# EAGLE design climate_control (EAGLE 7.4.0)
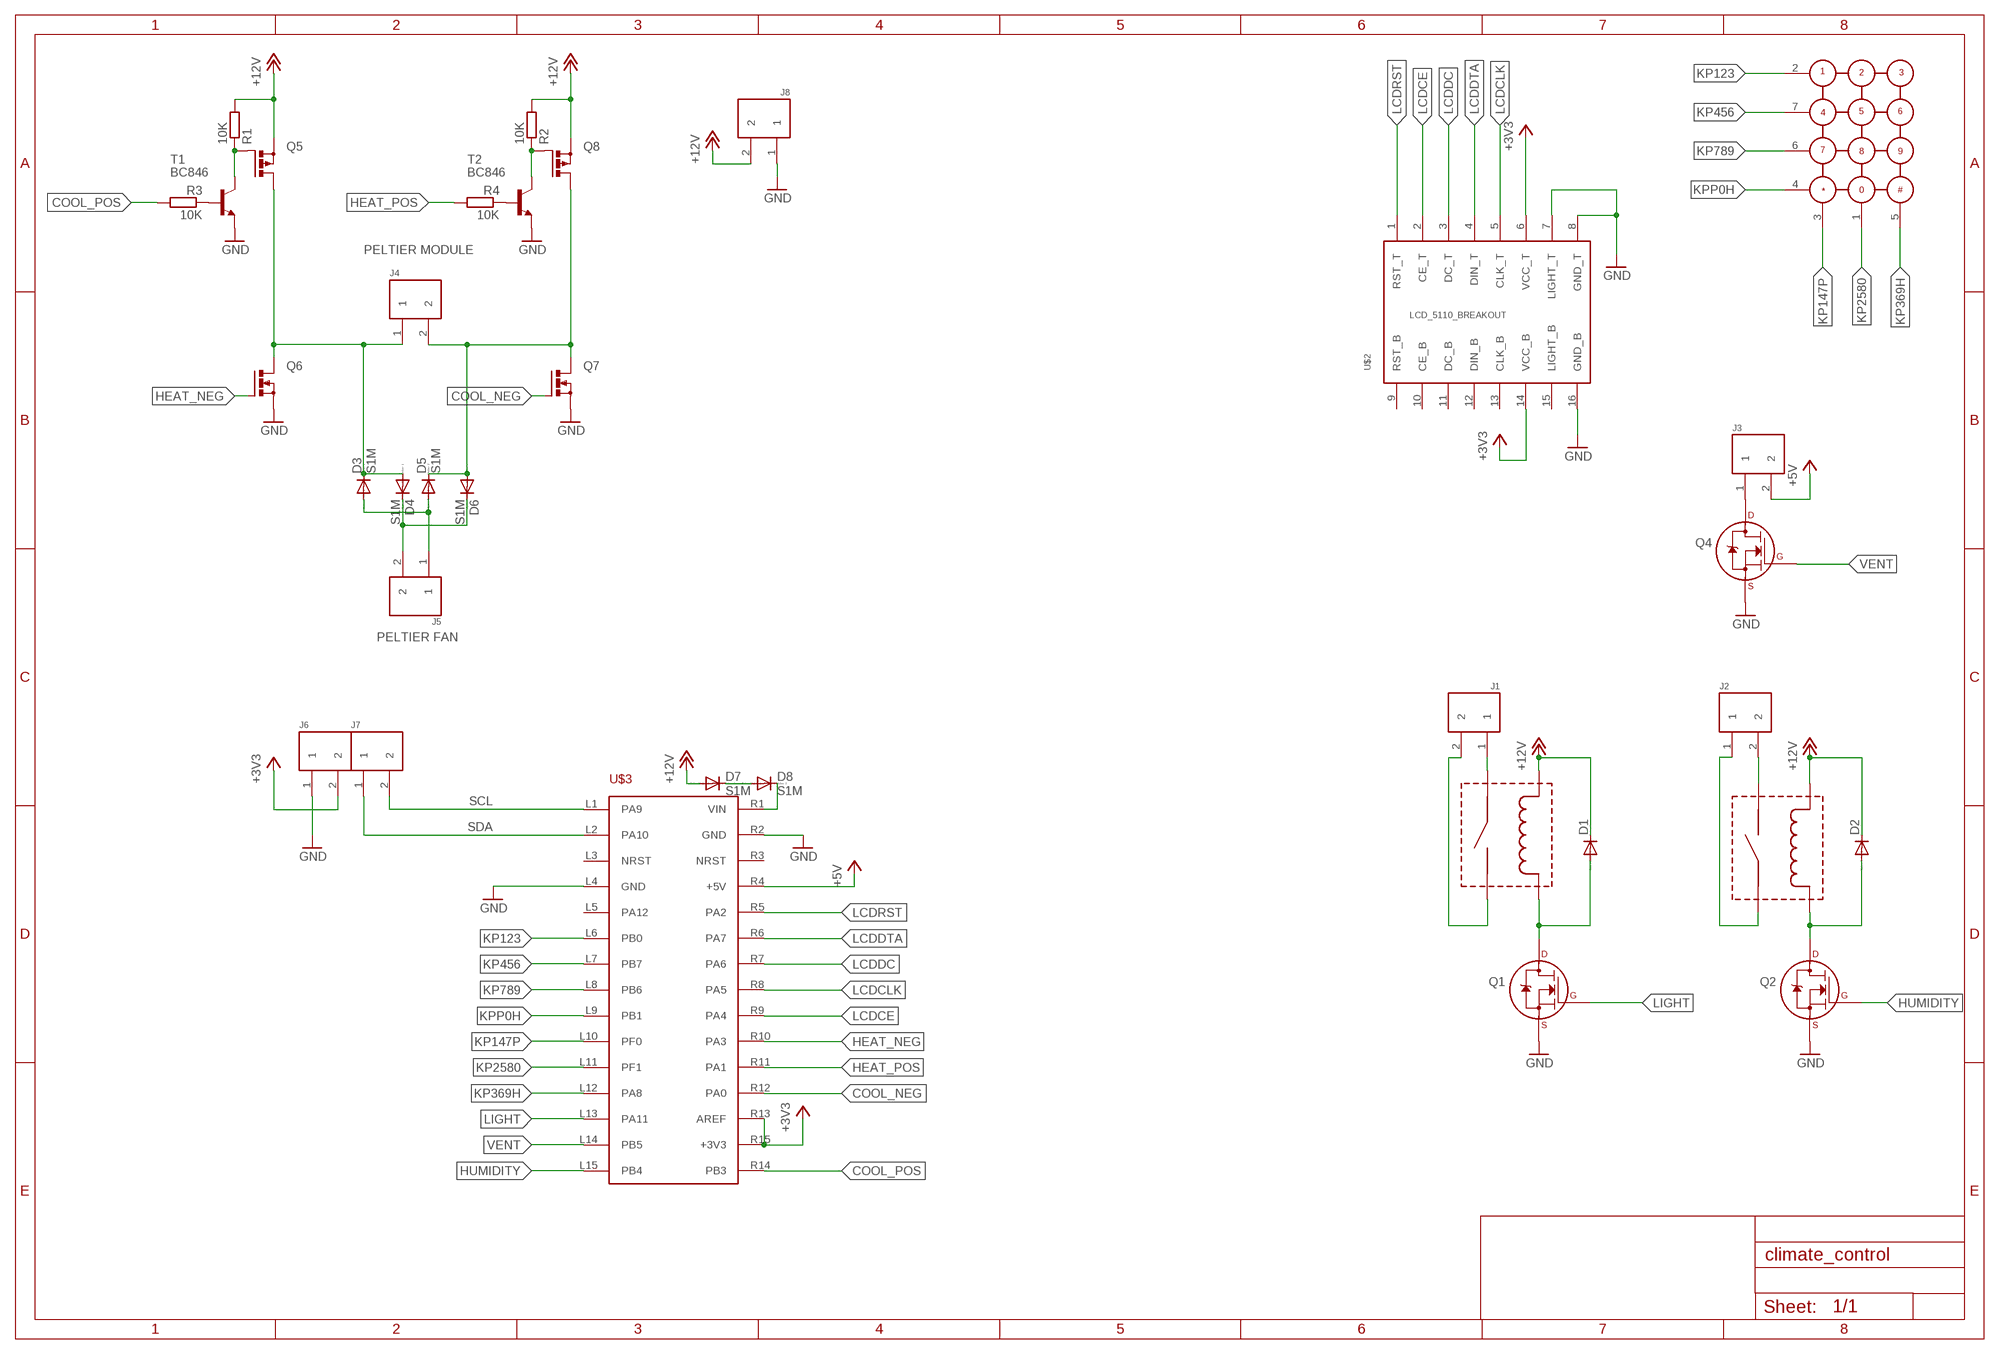
[diagram p0: schematic, sheet 1]

## Parts
D1  DIODE-DO-214AC  [DO-214AC]
D2  DIODE-DO-214AC  [DO-214AC]
D3  S1M  [SMA]
D4  S1M  [SMA]
D5  S1M  [SMA]
D6  S1M  [SMA]
D7  S1M  [SMA]
D8  S1M  [SMA]
J1  TERMINAL_PCB_508_X2  [TERMINAL_PCB_508_PITCH]
J2  TERMINAL_PCB_508_X2  [TERMINAL_PCB_508_PITCH]
J3  TERMINAL_PCB_508_X2  [TERMINAL_PCB_508_PITCH]
J4  TERMINAL_PCB_508_X2  [TERMINAL_PCB_508_PITCH]
J5  TERMINAL_PCB_508_X2  [TERMINAL_PCB_508_PITCH]
J6  TERMINAL_PCB_508_X2  [TERMINAL_PCB_508_PITCH]
J7  TERMINAL_PCB_508_X2  [TERMINAL_PCB_508_PITCH]
J8  TERMINAL_PCB_508_X2  [TERMINAL_PCB_508_PITCH]
Q1  2N7000_TO92  [TO-92]
Q2  2N7000_TO92  [TO-92]
Q4  2N7000_TO92  [TO-92]
Q5  PMOSFET_PTO220BV  [TO220BV]
Q6  PMOSFET_NTO220BV  [TO220BV]
Q7  PMOSFET_NTO220BV  [TO220BV]
Q8  PMOSFET_PTO220BV  [TO220BV]
R1  10K  R-EU_R0805  [R0805]
R2  10K  R-EU_R0805  [R0805]
R3  10K  R-EU_R0805  [R0805]
R4  10K  R-EU_R0805  [R0805]
T1  BC846  [SOT23]
T2  BC846  [SOT23]
U$1  KEYPAD12  [KEYPAD12]
U$2  LCD_5110_BREAKOUT  [LCD_5110_BREAKOUT]
U$3  NUCLEO_F031  [NUCLEO_30]
U$5  RELAY_JZC-33F  [RELAY_JZC-33F]
U$7  RELAY_JZC-33F  [RELAY_JZC-33F]

## Nets
+3V3: J6.2 U$2.6(VCC_T) U$2.14(VCC_B) U$3.R13(AREF) U$3.R15(+3V3)
+5V: J3.2 U$3.R4(+5V)
+12V: D1.C D2.C D7.A J8.2 Q5.S Q8.S R1.2 R2.2 U$5.COIL1 U$7.COIL2
COOL_NEG: Q7.G U$3.R12(PA0)
COOL_POS: R3.2 U$3.R14(PB3)
GND: J6.1 J8.1 Q1.1(S) Q2.1(S) Q4.1(S) Q6.S Q7.S T1.2(E) T2.2(E) U$2.7(LIGHT_T) U$2.8(GND_T) U$2.16(GND_B) U$3.L4(GND) U$3.R2(GND)
HEAT_NEG: Q6.G U$3.R10(PA3)
HEAT_POS: R4.2 U$3.R11(PA1)
HUMIDITY: Q2.2(G) U$3.L15(PB4)
KP123: U$1.2 U$3.L6(PB0)
KP147P: U$1.3(147*) U$3.L10(PF0)
KP369H: U$1.5(369#) U$3.L12(PA8)
KP456: U$1.7 U$3.L7(PB7)
KP789: U$1.6 U$3.L8(PB6)
KP2580: U$1.1 U$3.L11(PF1)
KPP0H: U$1.4(*0#) U$3.L9(PB1)
LCDCE: U$2.2(CE_T) U$3.R9(PA4)
LCDCLK: U$2.5(CLK_T) U$3.R8(PA5)
LCDDC: U$2.3(DC_T) U$3.R7(PA6)
LCDDTA: U$2.4(DIN_T) U$3.R6(PA7)
LCDRST: U$2.1(RST_T) U$3.R5(PA2)
LIGHT: Q1.2(G) U$3.L13(PA11)
N$1: D3.A D5.A J5.1
N$2: D7.C D8.A
N$3: D4.C D6.C J5.2
N$4: D3.C D4.A J4.1 Q5.D Q6.D
N$5: D5.C D6.A J4.2 Q7.D Q8.D
N$6: Q5.G R1.1 T1.3(C)
N$7: Q8.G R2.1 T2.3(C)
N$8: R3.1 T1.1(B)
N$9: R4.1 T2.1(B)
N$10: D8.C U$3.R1(VIN)
N$22: D1.A Q1.3(D) U$5.COIL2
N$23: J1.1 U$5.CONTACT1
N$25: J1.2 U$5.CONTACT2
N$26: D2.A Q2.3(D) U$7.COIL1
N$27: J2.2 U$7.CONTACT2
N$28: J2.1 U$7.CONTACT1
N$36: J3.1 Q4.3(D)
SCL: J7.2 U$3.L1(PA9)
SDA: J7.1 U$3.L2(PA10)
VENT: Q4.2(G) U$3.L14(PB5)
Unconnected: U$2.9(RST_B) U$2.10(CE_B) U$2.11(DC_B) U$2.12(DIN_B) U$2.13(CLK_B) U$2.15(LIGHT_B) U$3.L3(NRST) U$3.L5(PA12) U$3.R3(NRST)

## Notes on the sheet
- PELTIER MODULE
- PELTIER FAN

## Library data of the parts
D1 D2 = diode:DIODE-: DIODE
D3-D8 = diode:S1M
J1-J8 = custom:TERMINAL_PCB_508_X2
Q1 Q2 Q4 = transistors:2N700*: 2N7000, 2N7002, NDS7002A N-channel enhancement mode MOSFET
Q5 Q8 = transistor-power:PMOSFET_P: Power MOSFET P-Channel
Q6 Q7 = transistor-power:PMOSFET_N: Power MOSFET N-Channel
R1-R4 = rcl:R-EU_: RESISTOR, European symbol; SPEC: 100mW, +/-1%, 50V
T1 T2 = transistor:BC846: NPN TRANSISTOR
U$1 = KEYPAD12:KEYPAD12
U$2 = LCD5110:LCD_5110_BREAKOUT
U$3 = custom_module:NUCLEO_F031
U$5 U$7 = custom:RELAY_JZC-33F

## Board
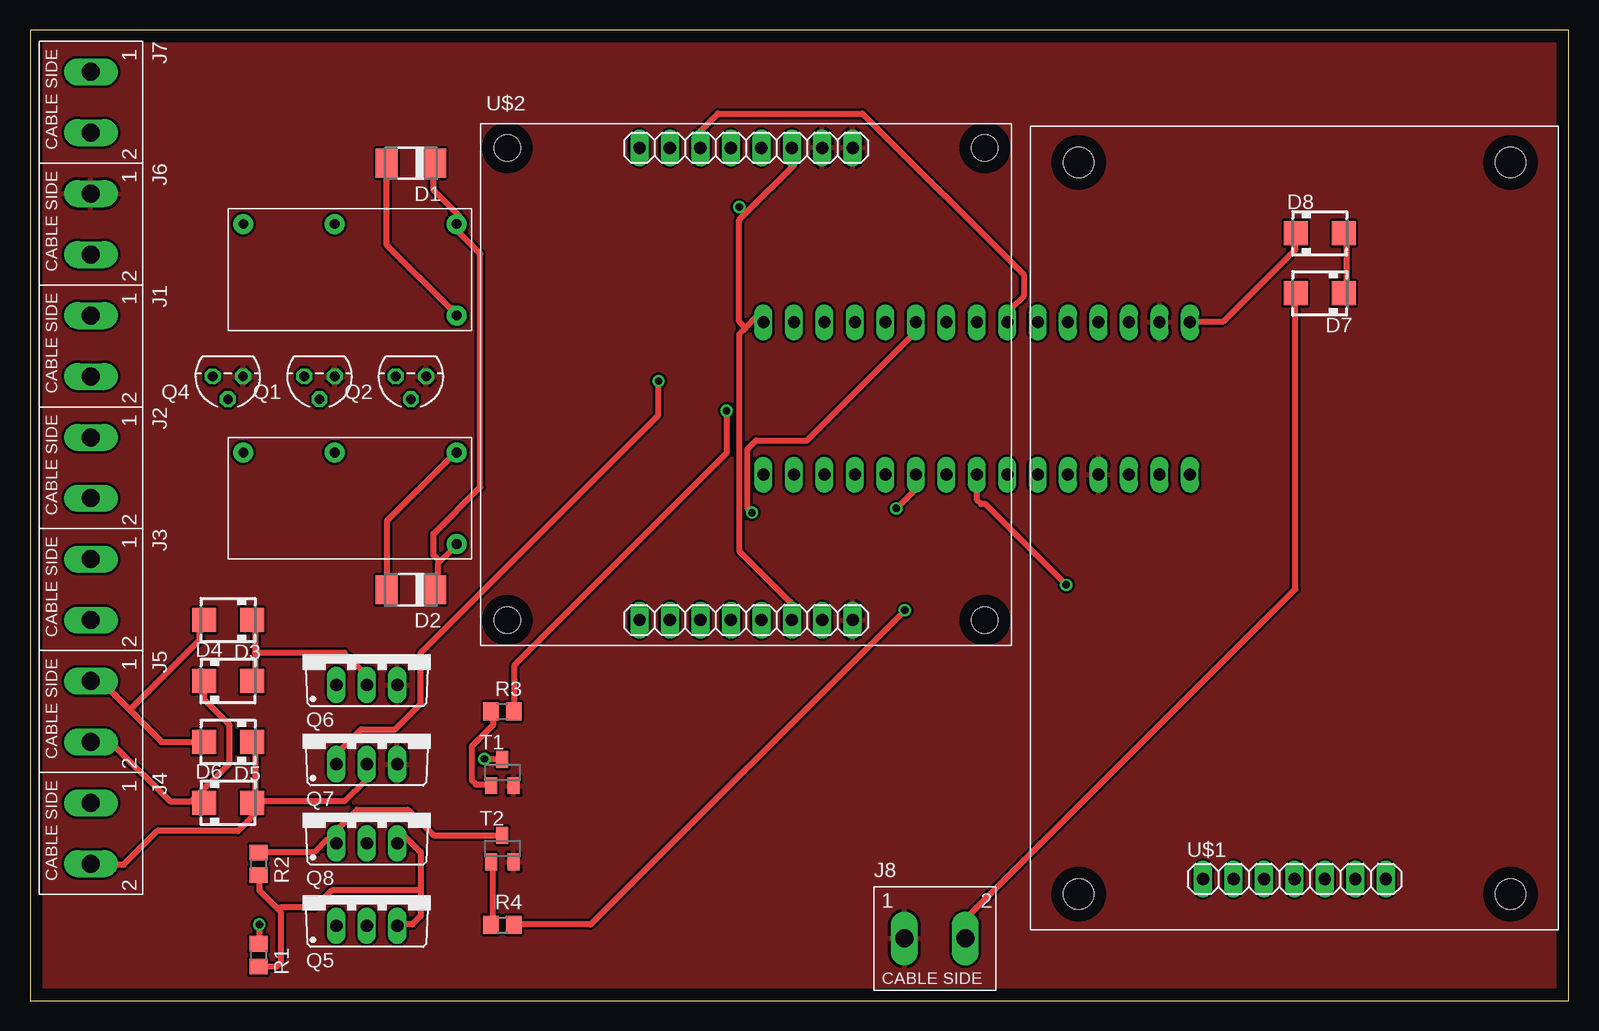
[diagram p1: board, top side]
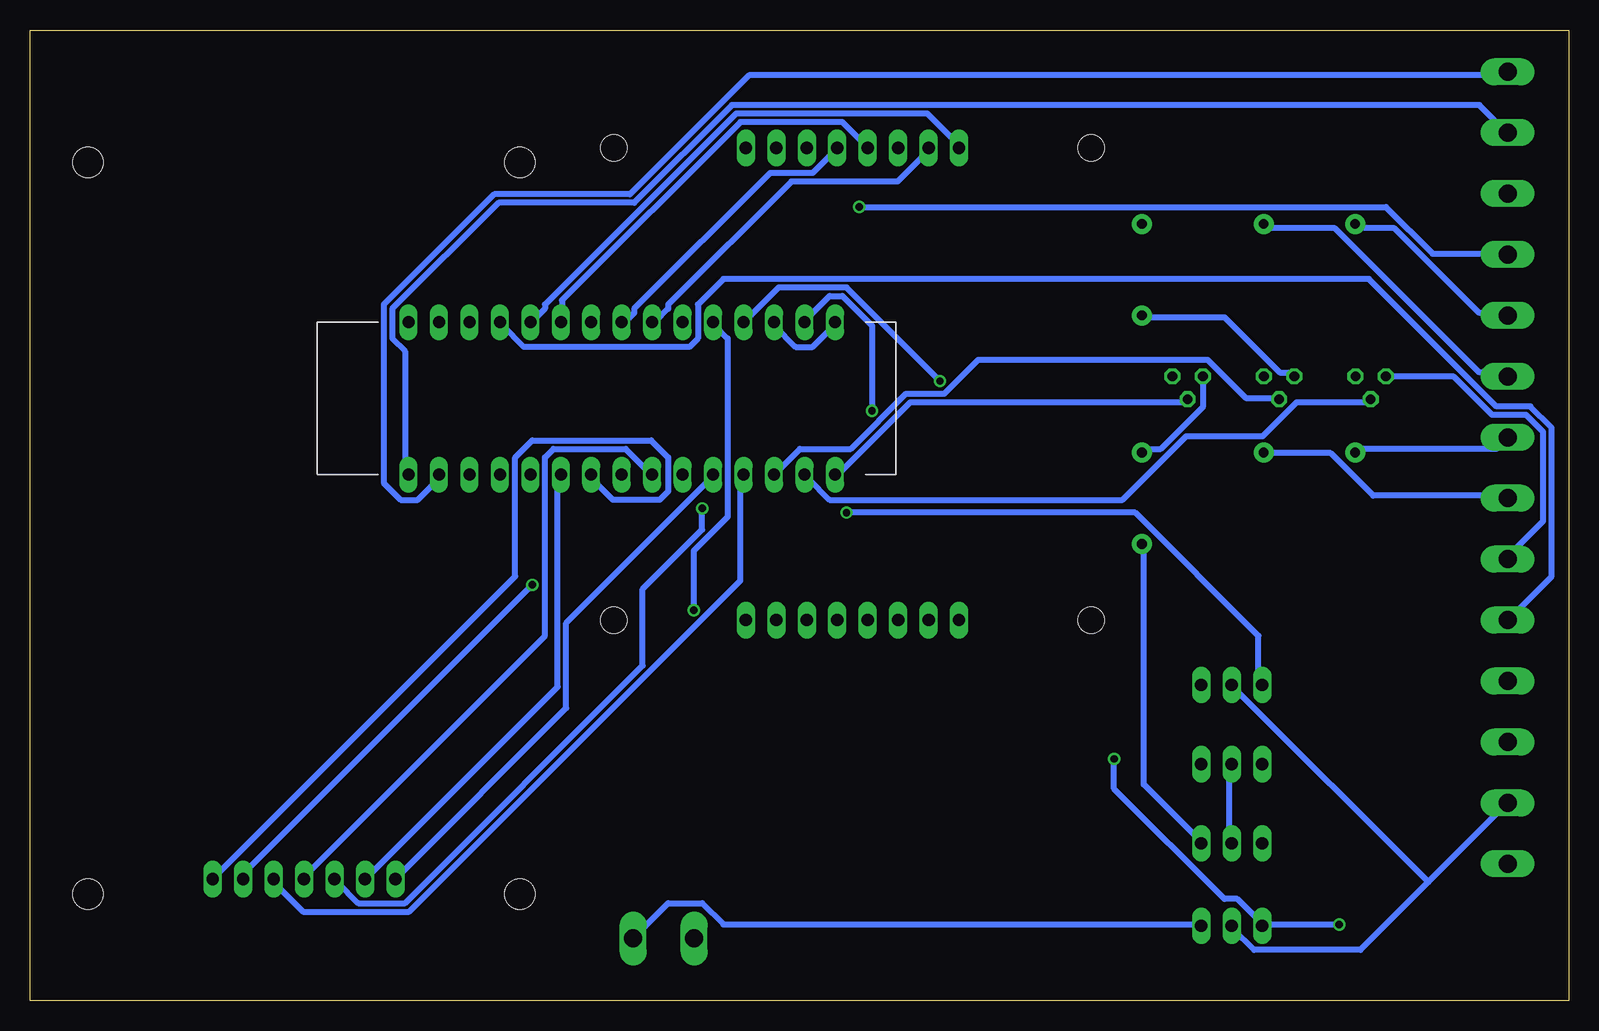
[diagram p2: board, bottom side, seen from below]

Size 128.25 x 80.95 mm. Coordinates in mm from the lower left corner, seen from the top.
Outline: 0,0 128.25,0 128.25,80.95 0,80.95 0,0
Copper layers (1*16): Top 0.035mm / dielectric 1.5mm / Bottom 0.035mm
Design rules "default *": minimum track width 20mil, minimum drill 24mil, track to track 0.2mm, track to pad 0.2mm, pad to pad 0.2mm, via to via 0.2mm, smd to smd 0.2mm, copper to edge 40mil, drill to drill 8mil, minimum pad ring 10mil, minimum via ring 8mil, stop-mask expansion 4mil, vias tented up to drill 0mil, thermal gap 10mil

### Footprints (pad centres in the part's own frame; a part is rotated, then mirrored left to right if it is on the bottom)
DO-214AC = smd 1.8 x 2.4: A 2.025,0; C -2.025,0
SMA = smd 2 x 2: A 2,0; C -2,0
TERMINAL_PCB_508_PITCH = drill 1.5 long: 1 0,0; 2 5.08,0
TO-92 = drill 0.813 octagon: 1 -1.27,0; 2 0,1.905; 3 1.27,0
TO220BV = drill 1.016 long: D 0,-2.54; G -2.54,-2.54; S 2.54,-2.54
R0805 = smd 1.3 x 1.5: 1 -0.95,0; 2 0.95,0
SOT23 = smd 1 x 1.4: 1 -0.95,-1.1; 2 0.95,-1.1; 3 0,1.1
KEYPAD12 = drill 1.016 long: 1 -7.62,0; 2 -5.08,0; 3 -2.54,0; 4 0,0; 5 2.54,0; 6 5.08,0; 7 7.62,0 | hole 2.5: -18,-1.25; 18,-1.25; -18,59.75; 18,59.75
LCD_5110_BREAKOUT = drill 1.016 long: 1 0,0; 2 2.54,0; 3 5.08,0; 4 7.62,0; 5 10.16,0; 6 12.7,0; 7 15.24,0; 8 17.78,0; 9 0,-39.37; 10 2.54,-39.37; 11 5.08,-39.37; 12 7.62,-39.37; 13 10.16,-39.37; 14 12.7,-39.37; 15 15.24,-39.37; 16 17.78,-39.37 | hole 2.2: -11,0; 28.8,0; -11,-39.37; 28.8,-39.37
NUCLEO_30 = drill 1 long: L1 -7.62,12.7; L2 -7.62,10.16; L3 -7.62,7.62; L4 -7.62,5.08; L5 -7.62,2.54; L6 -7.62,0; L7 -7.62,-2.54; L8 -7.62,-5.08; L9 -7.62,-7.62; L10 -7.62,-10.16; L11 -7.62,-12.7; L12 -7.62,-15.24; L13 -7.62,-17.78; L14 -7.62,-20.32; L15 -7.62,-22.86; R1 5.08,12.7; R2 5.08,10.16; R3 5.08,7.62; R4 5.08,5.08; R5 5.08,2.54; R6 5.08,0; R7 5.08,-2.54; R8 5.08,-5.08; R9 5.08,-7.62; R10 5.08,-10.16; R11 5.08,-12.7; R12 5.08,-15.24; R13 5.08,-17.78; R14 5.08,-20.32; R15 5.08,-22.86
RELAY_JZC-33F = drill 0.8 pad 1.676: COIL1 10.16,0; COIL2 10.16,-7.62; CONTACT1 -7.62,0; CONTACT2 0,0

### Placement (x,y rotation side)
D1  31.75,69.85 180 top
D2  31.75,34.29 180 top
D3  16.51,31.75 180 top
D4  16.51,26.67 0 top
D5  16.51,21.59 180 top
D6  16.51,16.51 0 top
D7  107.5,59 180 top
D8  107.5,64 0 top
J1  5.08,57.15 270 top
J2  5.08,46.99 270 top
J3  5.08,36.83 270 top
J4  5.08,16.51 270 top
J5  5.08,26.67 270 top
J6  5.08,67.31 270 top
J7  5.08,77.47 270 top
J8  72.89,5.21 0 top
Q1  24.13,52.07 180 top
Q2  31.75,52.07 180 top
Q4  16.49,52.07 180 top
Q5  28.08,8.81 0 top
Q6  28.08,28.88 0 top
Q7  28.08,22.28 0 top
Q8  28.08,15.68 0 top
R1  19.05,3.81 270 top
R2  19.05,11.43 270 top
R3  39.37,24.13 0 top
R4  39.37,6.35 0 top
T1  39.37,19.05 0 top
T2  39.37,12.7 0 top
U$1  105.41,10.16 0 top
U$2  50.8,71.12 0 top
U$3  84,51.5 90 bottom
U$5  25.4,64.77 0 top
U$7  25.4,45.72 0 top

### Tracks (layer width: path | path; a pad name or v marks a point on that pad's centre or on a via)
+3V3  (via drill 0.61)
  Top 0.508: 59.65,56.11 60.53,56.99 60.89,56.99 61.24,56.64 U$3.R15 | 59.65,56.11 59.12,55.58 59.12,37.52 63.37,33.28 63.37,31.86 U$2.14 | 59.65,65.67 59.12,65.14 59.12,56.64 59.65,56.11 | 59.65,65.67 63.72,69.74 63.72,70.8 U$2.6 | 59.65,65.67 v59.12,66.2
  Bottom 0.508: U$3.R15 61.24,56.29 63.01,54.52 64.43,54.52 66.2,56.29 U$3.R13 | v59.12,66.2 15.22,66.2 11.33,62.3 5.31,62.3 J6.2
+5V
  Bottom 0.508: U$3.R4 88.85,56.29 87.08,54.52 73.28,54.52 72.57,55.22 72.57,58.06 70.45,60.18 16.64,60.18 6.02,49.56 3.19,49.56 1.42,47.79 1.42,35.4 4.96,31.86 J3.2
+12V
  Top 0.508: D1.C 33.63,69.74 33.63,67.61 35.75,65.49 35.75,64.78 U$5.COIL1 35.75,64.43 35.75,64.07 37.52,62.3 37.52,42.83 33.63,38.94 33.63,37.17 34.16,36.64 | 34.16,36.64 35.05,37.52 35.05,37.88 35.4,38.23 U$7.COIL2 | 34.16,36.64 33.98,36.46 33.98,34.34 D2.C | 20.71,7.61 19.12,9.2 19.12,10.27 R2.2 | 20.71,7.61 20.89,7.43 20.89,3.19 20.53,2.83 19.12,2.83 R1.2 | 32.57,9.2 32.57,12.39 31.15,13.81 30.8,13.81 30.44,13.45 Q8.S | 32.57,9.2 32.57,7.08 31.86,6.37 30.8,6.37 Q5.S | 32.57,9.2 25.13,9.2 23.72,7.79 20.89,7.79 20.71,7.61 | D7.A 105.49,58.76 105.49,34.34 78.23,7.08 78.23,5.31 J8.2
  Bottom 0.508: U$7.COIL2 35.4,37.88 35.4,18.05 30.8,13.45 Q8.S | Q5.S 30.8,6.37 70.45,6.37 72.22,8.14 75.05,8.14 77.88,5.31 J8.2
COOL_NEG  (via drill 0.61)
  Top 0.508: v52.39,51.68 52.39,48.85 32.57,29.03 32.57,24.78 30.44,22.66 27.61,22.66 25.84,20.89 25.84,19.82 Q7.G
  Bottom 0.508: v52.39,51.68 60.18,59.47 65.84,59.47 68.68,56.64 U$3.R12
COOL_POS  (via drill 0.61)
  Top 0.508: v58.06,49.21 58.06,45.67 40.36,27.97 40.36,24.43 R3.2
  Bottom 0.508: v58.06,49.21 58.06,56.29 60.53,58.76 61.6,58.76 63.72,56.64 U$3.R14
GND
  pour Top: 0.5,80.5 0.5,0.5 128,0.5 128,80.5
HEAT_NEG  (via drill 0.61)
  Top 0.508: v60.18,40.71 59.83,41.06 59.83,46.02 60.53,46.73 64.78,46.73 73.63,55.58 73.63,56.29 U$3.R10
  Bottom 0.508: v60.18,40.71 36.11,40.71 25.84,30.44 25.84,26.55 Q6.G
HEAT_POS  (via drill 0.61)
  Top 0.508: v72.92,32.57 46.73,6.37 40.36,6.37 R4.2
  Bottom 0.508: v72.92,32.57 72.92,37.52 70.09,40.36 70.09,55.22 71.15,56.29 U$3.R11
HUMIDITY
  Bottom 0.508: Q2.2 31.86,49.91 54.87,49.91 60.89,43.9 U$3.L15
KP123
  Bottom 0.508: U$3.L6 84.25,43.54 84.25,26.2 100.18,10.27 U$1.2
KP147P  (via drill 0.61)
  Top 0.508: v72.22,41.06 73.63,42.48 73.63,43.54 U$3.L10
  Bottom 0.508: v72.22,41.06 72.22,39.29 77.17,34.34 77.17,27.97 97,8.14 100.89,8.14 102.66,9.91 U$1.3
KP369H
  Bottom 0.508: U$3.L12 69.03,43.54 69.03,35.05 96.64,7.43 105.49,7.43 107.97,9.91 U$1.5
KP456
  Bottom 0.508: U$3.L7 81.42,43.54 79.65,41.77 75.76,41.77 75.05,42.48 75.05,45.31 76.46,46.73 86.38,46.73 87.79,45.31 87.79,35.4 112.93,10.27 U$1.7
KP789  (via drill 0.61)
  Top 0.508: v86.38,34.69 79.65,41.42 79.3,41.42 78.94,41.77 78.94,43.54 U$3.L8
  Bottom 0.508: v86.38,34.69 110.8,10.27 U$1.6
KP2580
  Bottom 0.508: U$3.L11 71.51,43.54 83.54,31.51 83.54,24.43 97.7,10.27 U$1.1
KPP0H
  Bottom 0.508: U$3.L9 76.46,43.9 78.59,46.02 84.61,46.02 85.31,45.31 85.31,30.44 105.49,10.27 U$1.4
LCDCE
  Bottom 0.508: U$3.R9 76.11,56.64 75.05,57.7 75.05,58.06 64.78,68.32 55.93,68.32 53.45,70.8 U$2.2
LCDCLK
  Bottom 0.508: U$3.R8 78.59,56.64 77.88,57.35 77.88,57.7 66.55,69.03 63.01,69.03 61.24,70.8 U$2.5
LCDDC
  Top 0.508: U$3.R7 81.77,56.64 81.77,57.7 82.84,58.76 82.84,60.53 69.38,73.99 57.35,73.99 55.93,72.57 55.93,71.15 U$2.3
LCDDTA
  Bottom 0.508: U$3.R6 83.9,56.64 83.9,58.41 69.03,73.28 60.53,73.28 58.41,71.15 U$2.4
LCDRST
  Bottom 0.508: U$3.R5 86.38,56.64 85.31,57.7 85.31,58.06 69.38,73.99 53.45,73.99 50.62,71.15 U$2.1
LIGHT
  Bottom 0.508: Q1.2 24.43,50.27 26.9,50.27 30.09,53.45 49.21,53.45 52.04,50.62 55.22,50.62 59.83,46.02 64.07,46.02 66.2,43.9 U$3.L13
N$1
  Top 0.508: 8.32,24.25 6.02,26.55 5.31,26.55 J5.1 | 8.32,24.25 10.97,21.59 14.16,21.59 D5.A | 8.32,24.25 14.16,30.09 14.16,31.51 D3.A
N$2
  Top 0.508: D7.C 109.74,59.12 109.74,63.72 D8.A
N$3
  Top 0.508: 13.45,16.64 11.68,16.64 7.08,21.24 5.31,21.24 J5.2 | 13.45,16.64 14.16,16.64 D6.C | 13.45,16.64 16.64,19.82 16.64,23.01 14.51,25.13 14.51,26.55 D4.C
N$4
  Top 0.508: 18.76,29.03 18.76,31.51 D3.C | 18.76,29.03 18.76,26.9 D4.A | 18.76,29.03 26.2,29.03 27.97,27.26 27.97,26.55 Q6.D
  Bottom 0.508: 11.68,9.91 5.31,16.28 J4.1 | 11.68,9.91 17.35,4.25 26.2,4.25 27.97,6.02 Q5.D | 11.68,9.91 27.97,26.2 Q6.D
N$5
  Top 0.508: 18.76,16.64 18.76,21.24 D5.C | 18.76,16.64 26.2,16.64 27.97,18.41 27.97,19.47 Q7.D | 18.76,16.64 D6.A 18.76,16.28 18.76,15.58 17.35,14.16 10.62,14.16 7.79,11.33 5.31,11.33 J4.2
  Bottom 0.508: Q8.D 28.32,13.45 28.32,19.47 Q7.D
N$6  (via drill 0.61)
  Top 0.508: v37.88,20.18 39.29,20.18 T1.3 | v19.12,6.37 19.12,4.96 R1.1
  Bottom 0.508: v37.88,20.18 37.88,17.7 28.67,8.5 27.61,8.5 25.49,6.37 | 25.49,6.37 v19.12,6.37 | 25.49,6.37 Q5.G
N$7
  Top 0.508: T2.3 39.29,13.81 33.63,13.81 31.51,15.93 27.26,15.93 25.84,14.51 25.84,13.45 Q8.G 25.49,13.45 24.78,13.45 23.72,12.39 19.12,12.39 R2.1
N$8
  Top 0.508: T1.1 38.23,18.05 37.17,18.05 36.82,18.41 36.82,21.24 38.59,23.01 38.59,24.07 R3.1
N$9
  Top 0.508: T2.1 38.59,11.33 38.59,6.37 R4.1
N$10
  Top 0.508: D8.C 105.49,63.72 105.49,62.66 99.47,56.64 97,56.64 U$3.R1
N$22
  Top 0.508: D1.A 29.74,69.74 29.74,63.01 35.05,57.7 35.4,57.7 35.75,57.35 U$5.COIL2
  Bottom 0.508: Q1.3 23.01,52.39 24.07,52.39 28.67,56.99 35.4,56.99 U$5.COIL2
N$23
  Bottom 0.508: U$5.CONTACT1 17.7,64.43 14.51,64.43 7.43,57.35 5.31,57.35 J1.1
N$25
  Bottom 0.508: U$5.CONTACT2 25.13,64.43 19.47,64.43 7.43,52.39 5.31,52.39 J1.2
N$26
  Top 0.508: D2.A 29.74,34.34 29.74,40 35.05,45.31 35.05,45.67 35.4,46.02 U$7.COIL1
  Bottom 0.508: Q2.3 30.44,52.04 30.44,49.56 33.98,46.02 35.4,46.02 U$7.COIL1
N$27
  Bottom 0.508: U$7.CONTACT2 25.13,45.67 19.82,45.67 16.28,42.13 5.31,42.13 J2.2
N$28
  Bottom 0.508: U$7.CONTACT1 17.7,46.02 6.02,46.02 5.31,46.73 J2.1
N$36
  Bottom 0.508: Q4.3 14.87,52.04 9.56,52.04 6.37,48.85 3.54,48.85 2.12,47.44 2.12,40 4.96,37.17 J3.1
SCL
  Bottom 0.508: U$3.L1 97,43.9 97,54.16 98.06,55.22 98.06,57.7 89.21,66.55 77.88,66.55 69.74,74.69 7.43,74.69 5.31,72.57 J7.2
SDA
  Bottom 0.508: U$3.L2 94.16,43.54 95.93,41.77 97.35,41.77 98.77,43.19 98.77,58.06 89.56,67.26 78.23,67.26 68.32,77.17 5.31,77.17 J7.1
VENT
  Bottom 0.508: Q4.2 16.64,49.91 22.66,49.91 25.49,47.08 31.86,47.08 37.17,41.77 61.6,41.77 63.37,43.54 U$3.L14